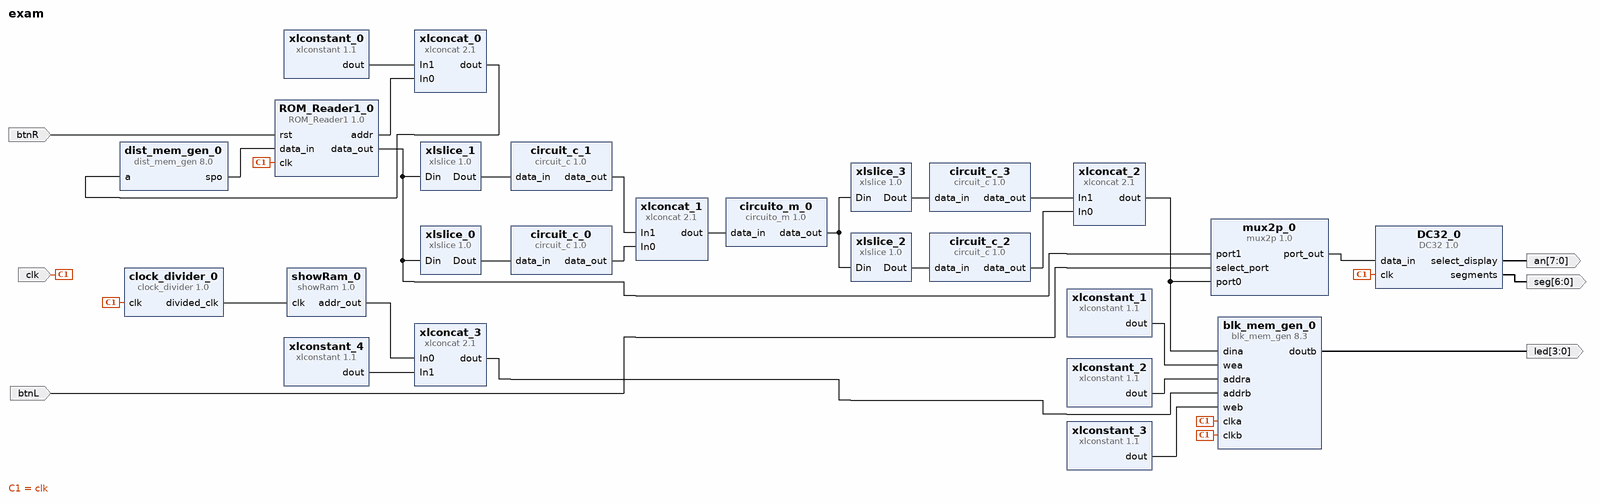
[diagram p0: block diagram of the top level]
# Vivado block design exam, Vivado 2015.4
create_bd_design exam

create_bd_port -dir I clk
create_bd_port -dir I btnR
create_bd_port -dir O -from 6 -to 0 seg
create_bd_port -dir O -from 7 -to 0 an
create_bd_port -dir I btnL
create_bd_port -dir O -from 3 -to 0 led

create_bd_cell -type ip -vlnv xilinx.com:ip:dist_mem_gen:8.0 dist_mem_gen_0
set_property -dict [list \
  CONFIG.depth 16 \
  CONFIG.data_width 4 \
  CONFIG.memory_type rom \
  CONFIG.coefficient_file ../../../../../../../memoria.coe \
] [get_bd_cells dist_mem_gen_0]
create_bd_cell -type ip -vlnv user.org:user:ROM_Reader1:1.0 ROM_Reader1_0
set_property -dict {CONFIG.data_width 4 CONFIG.address_bits 3} [get_bd_cells ROM_Reader1_0]
create_bd_cell -type ip -vlnv xilinx.com:ip:xlconcat:2.1 xlconcat_0
set_property -dict {CONFIG.IN0_WIDTH 3 CONFIG.IN1_WIDTH 1} [get_bd_cells xlconcat_0]
create_bd_cell -type ip -vlnv xilinx.com:ip:xlconstant:1.1 xlconstant_0
set_property -dict {CONFIG.CONST_VAL 0} [get_bd_cells xlconstant_0]
create_bd_cell -type ip -vlnv ua.pt:user:DC32:1.0 DC32_0
create_bd_cell -type ip -vlnv user.org:user:mux2p:1.0 mux2p_0
set_property -dict {CONFIG.data_width 32} [get_bd_cells mux2p_0]
create_bd_cell -type ip -vlnv user.org:user:circuit_c:1.0 circuit_c_0
create_bd_cell -type ip -vlnv xilinx.com:ip:xlslice:1.0 xlslice_0
set_property -dict {CONFIG.DOUT_WIDTH 16 CONFIG.DIN_FROM 15} [get_bd_cells xlslice_0]
create_bd_cell -type ip -vlnv xilinx.com:ip:xlslice:1.0 xlslice_1
set_property -dict {CONFIG.DOUT_WIDTH 16 CONFIG.DIN_TO 16 CONFIG.DIN_FROM 31} [get_bd_cells xlslice_1]
create_bd_cell -type ip -vlnv user.org:user:circuit_c:1.0 circuit_c_1
create_bd_cell -type ip -vlnv xilinx.com:ip:xlconcat:2.1 xlconcat_1
set_property -dict {CONFIG.IN0_WIDTH 16 CONFIG.IN1_WIDTH 16} [get_bd_cells xlconcat_1]
create_bd_cell -type ip -vlnv xilinx.com:ip:xlslice:1.0 xlslice_2
set_property -dict {CONFIG.DOUT_WIDTH 16 CONFIG.DIN_FROM 15} [get_bd_cells xlslice_2]
create_bd_cell -type ip -vlnv xilinx.com:ip:xlslice:1.0 xlslice_3
set_property -dict {CONFIG.DOUT_WIDTH 16 CONFIG.DIN_TO 16 CONFIG.DIN_FROM 31} [get_bd_cells xlslice_3]
create_bd_cell -type ip -vlnv xilinx.com:ip:xlconcat:2.1 xlconcat_2
set_property -dict {CONFIG.IN0_WIDTH 16 CONFIG.IN1_WIDTH 16} [get_bd_cells xlconcat_2]
create_bd_cell -type ip -vlnv user.org:user:circuit_c:1.0 circuit_c_2
create_bd_cell -type ip -vlnv user.org:user:circuit_c:1.0 circuit_c_3
create_bd_cell -type ip -vlnv user.org:user:circuito_m:1.0 circuito_m_0
create_bd_cell -type ip -vlnv xilinx.com:ip:blk_mem_gen:8.3 blk_mem_gen_0
set_property -dict [list \
  CONFIG.Memory_Type True_Dual_Port_RAM \
  CONFIG.Enable_32bit_Address false \
  CONFIG.Use_Byte_Write_Enable false \
  CONFIG.Write_Width_A 32 \
  CONFIG.Write_Depth_A 8 \
  CONFIG.Read_Width_A 4 \
  CONFIG.Enable_A Always_Enabled \
  CONFIG.Write_Width_B 32 \
  CONFIG.Read_Width_B 4 \
  CONFIG.Enable_B Always_Enabled \
  CONFIG.Register_PortA_Output_of_Memory_Primitives false \
  CONFIG.Register_PortB_Output_of_Memory_Primitives false \
  CONFIG.Fill_Remaining_Memory_Locations true \
  CONFIG.Use_RSTA_Pin false \
  CONFIG.Port_B_Clock 100 \
  CONFIG.Port_B_Write_Rate 50 \
  CONFIG.Port_B_Enable_Rate 100 \
  CONFIG.use_bram_block Stand_Alone \
] [get_bd_cells blk_mem_gen_0]
create_bd_cell -type ip -vlnv xilinx.com:ip:xlconstant:1.1 xlconstant_1
create_bd_cell -type ip -vlnv xilinx.com:ip:xlconstant:1.1 xlconstant_2
set_property -dict {CONFIG.CONST_WIDTH 6 CONFIG.CONST_VAL 0} [get_bd_cells xlconstant_2]
create_bd_cell -type ip -vlnv xilinx.com:ip:xlconstant:1.1 xlconstant_3
set_property -dict {CONFIG.CONST_VAL 0} [get_bd_cells xlconstant_3]
create_bd_cell -type ip -vlnv ua.pt:user:clock_divider:1.0 clock_divider_0
create_bd_cell -type ip -vlnv xilinx.com:ip:xlconcat:2.1 xlconcat_3
set_property -dict {CONFIG.IN0_WIDTH 4 CONFIG.IN1_WIDTH 2} [get_bd_cells xlconcat_3]
create_bd_cell -type ip -vlnv xilinx.com:ip:xlconstant:1.1 xlconstant_4
set_property -dict {CONFIG.CONST_WIDTH 2 CONFIG.CONST_VAL 0} [get_bd_cells xlconstant_4]
create_bd_cell -type ip -vlnv user.org:user:showRam:1.0 showRam_0

# ---- connections ----

connect_bd_net [get_bd_ports clk] \
  [get_bd_pins ROM_Reader1_0/clk] [get_bd_pins DC32_0/clk] [get_bd_pins blk_mem_gen_0/clka] [get_bd_pins blk_mem_gen_0/clkb] \
  [get_bd_pins clock_divider_0/clk]
connect_bd_net [get_bd_ports btnR] [get_bd_pins ROM_Reader1_0/rst]
connect_bd_net [get_bd_pins dist_mem_gen_0/spo] [get_bd_pins ROM_Reader1_0/data_in]
connect_bd_net [get_bd_pins xlconcat_0/dout] [get_bd_pins dist_mem_gen_0/a]
connect_bd_net [get_bd_pins ROM_Reader1_0/addr] [get_bd_pins xlconcat_0/In0]
connect_bd_net [get_bd_pins xlconstant_0/dout] [get_bd_pins xlconcat_0/In1]
connect_bd_net [get_bd_pins DC32_0/segments] [get_bd_ports seg]
connect_bd_net [get_bd_pins DC32_0/select_display] [get_bd_ports an]
connect_bd_net [get_bd_pins mux2p_0/port_out] [get_bd_pins DC32_0/data_in]
connect_bd_net [get_bd_pins ROM_Reader1_0/data_out] [get_bd_pins mux2p_0/port1] [get_bd_pins xlslice_0/Din] [get_bd_pins xlslice_1/Din]
connect_bd_net [get_bd_ports btnL] [get_bd_pins mux2p_0/select_port]
connect_bd_net [get_bd_pins xlslice_0/Dout] [get_bd_pins circuit_c_0/data_in]
connect_bd_net [get_bd_pins xlslice_1/Dout] [get_bd_pins circuit_c_1/data_in]
connect_bd_net [get_bd_pins circuit_c_0/data_out] [get_bd_pins xlconcat_1/In0]
connect_bd_net [get_bd_pins circuit_c_1/data_out] [get_bd_pins xlconcat_1/In1]
connect_bd_net [get_bd_pins xlslice_2/Dout] [get_bd_pins circuit_c_2/data_in]
connect_bd_net [get_bd_pins circuit_c_2/data_out] [get_bd_pins xlconcat_2/In0]
connect_bd_net [get_bd_pins xlslice_3/Dout] [get_bd_pins circuit_c_3/data_in]
connect_bd_net [get_bd_pins circuit_c_3/data_out] [get_bd_pins xlconcat_2/In1]
connect_bd_net [get_bd_pins xlconcat_2/dout] [get_bd_pins mux2p_0/port0] [get_bd_pins blk_mem_gen_0/dina]
connect_bd_net [get_bd_pins xlconcat_1/dout] [get_bd_pins circuito_m_0/data_in]
connect_bd_net [get_bd_pins circuito_m_0/data_out] [get_bd_pins xlslice_2/Din] [get_bd_pins xlslice_3/Din]
connect_bd_net [get_bd_pins xlconstant_1/dout] [get_bd_pins blk_mem_gen_0/wea]
connect_bd_net [get_bd_pins xlconstant_2/dout] [get_bd_pins blk_mem_gen_0/addra]
connect_bd_net [get_bd_pins xlconstant_3/dout] [get_bd_pins blk_mem_gen_0/web]
connect_bd_net [get_bd_pins clock_divider_0/divided_clk] [get_bd_pins showRam_0/clk]
connect_bd_net [get_bd_pins blk_mem_gen_0/doutb] [get_bd_ports led]
connect_bd_net [get_bd_pins showRam_0/addr_out] [get_bd_pins xlconcat_3/In0]
connect_bd_net [get_bd_pins xlconcat_3/dout] [get_bd_pins blk_mem_gen_0/addrb]
connect_bd_net [get_bd_pins xlconstant_4/dout] [get_bd_pins xlconcat_3/In1]

validate_bd_design
save_bd_design
